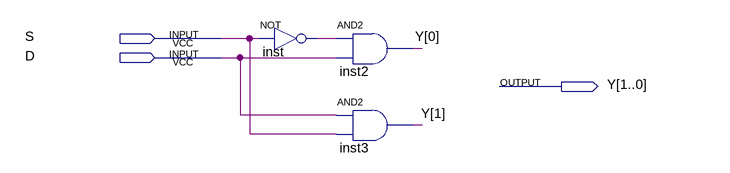
[diagram p0: schematic sheet]
// Quartus schematic DEMUX12.bdf as structural Verilog: 3 symbols, 3 pins
module DEMUX12 (
  input  S,
  input  D,
  output [1:0] Y
);

  wire inst_out;

  not inst (inst_out, S);
  and inst2 (Y[0], inst_out, D);
  and inst3 (Y[1], D, S);
endmodule
